# EAGLE design power-new-version (EAGLE 9.5.1)
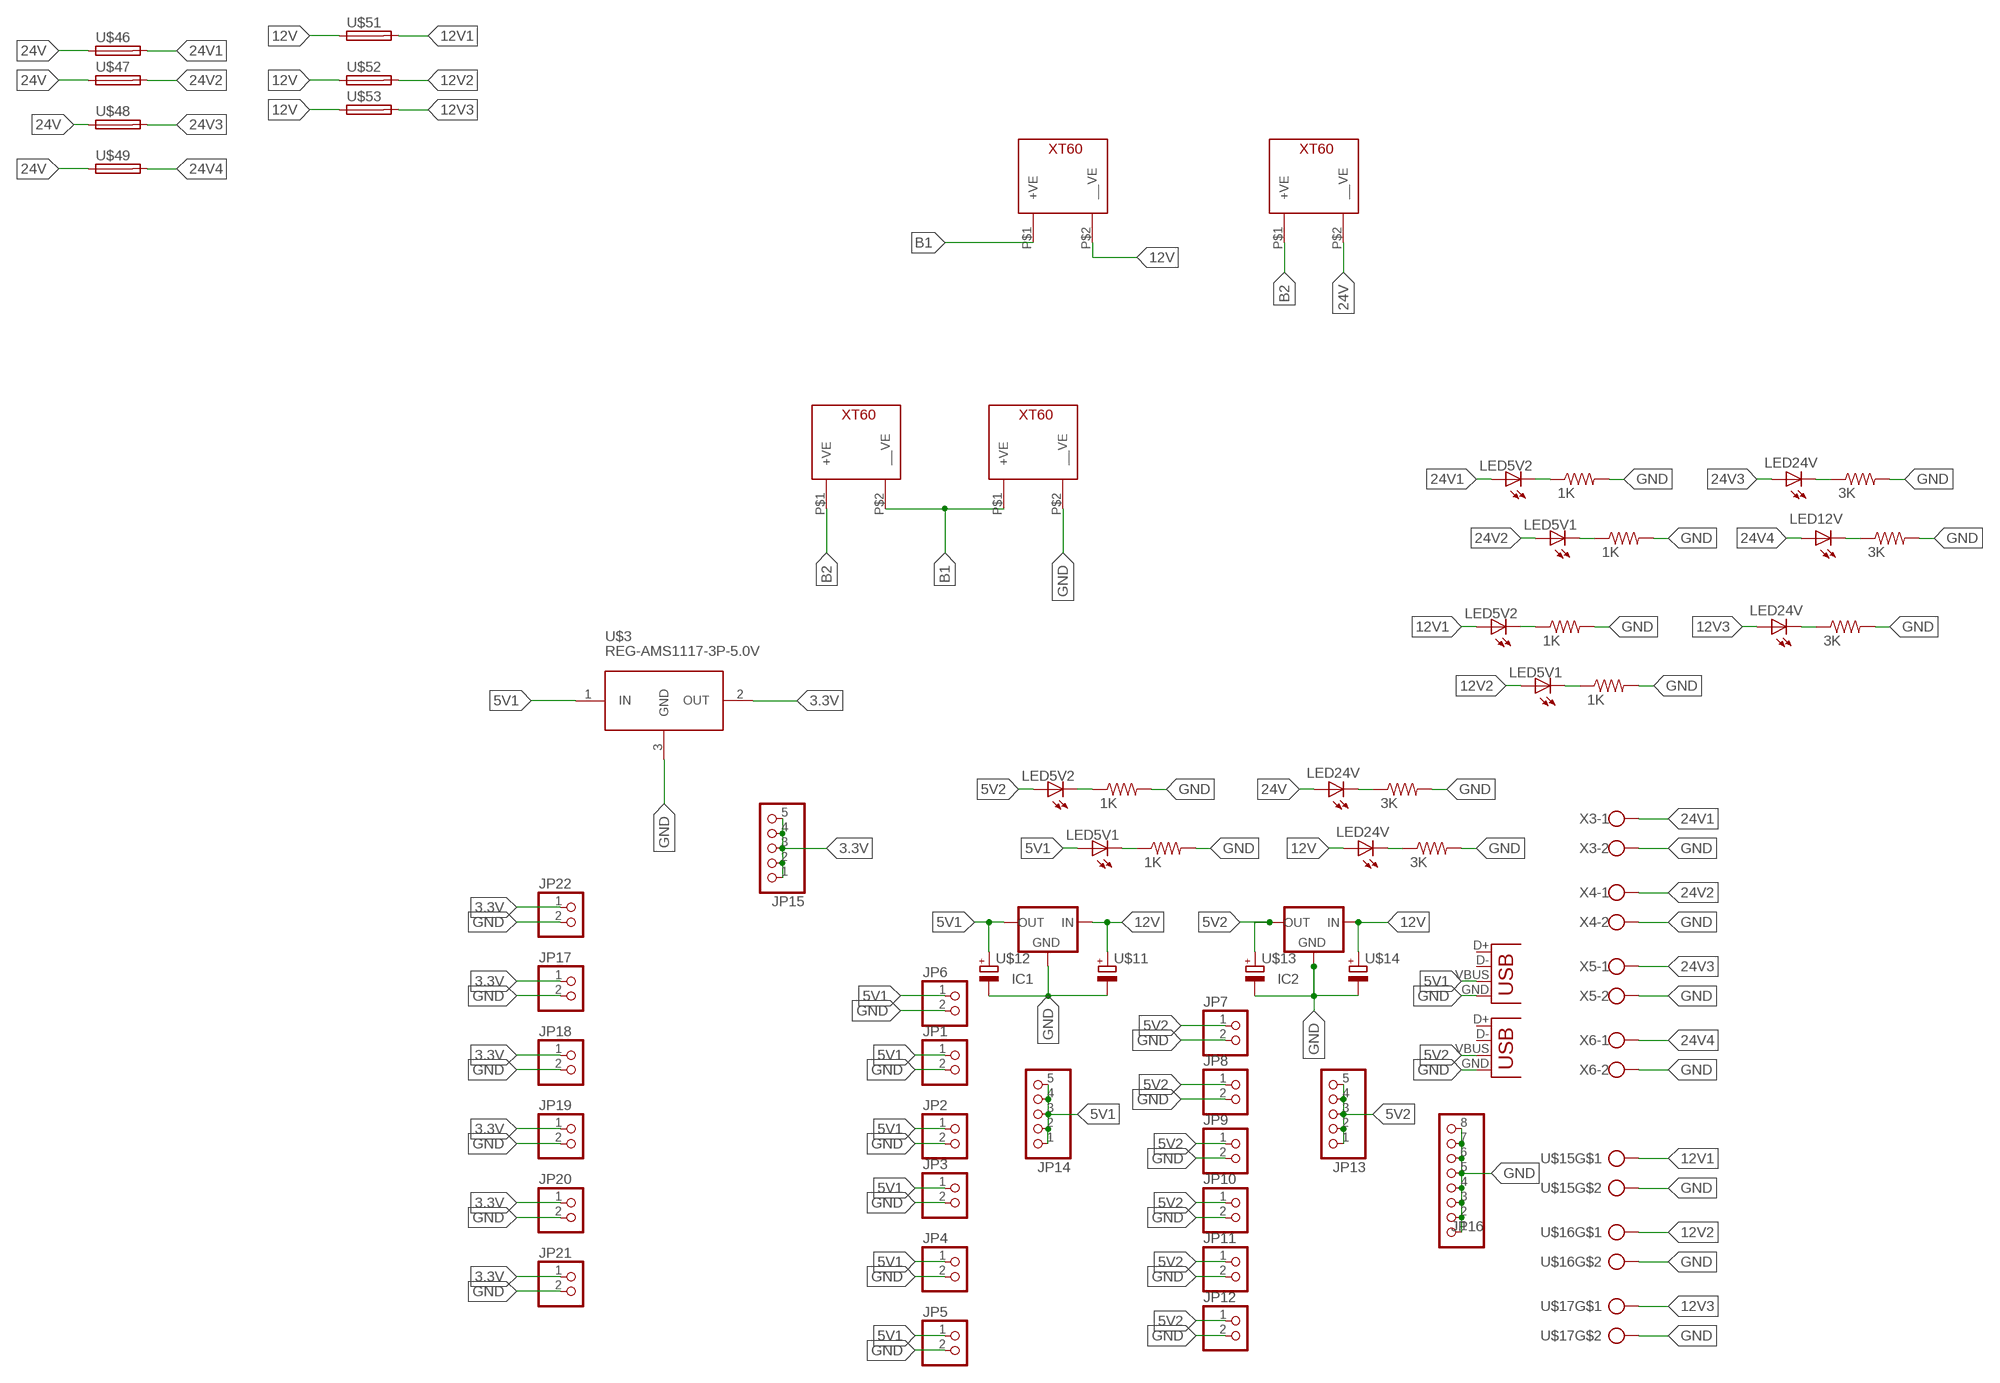
[diagram p0: schematic, sheet 1]

## Parts
1K  1K  RES-7  [0204/7]
1K1  1K  RES-7  [0204/7]
1K2  1K  RES-7  [0204/7]
IC1  78XX-METAL  [TO3-79]
IC2  78XX-METAL  [TO3-79]
JP1  PINHD-2_DATA  [1X02_DATA]
JP2  PINHD-2_DATA  [1X02_DATA]
JP3  PINHD-2_DATA  [1X02_DATA]
JP4  PINHD-2_DATA  [1X02_DATA]
JP5  PINHD-2_DATA  [1X02_DATA]
JP6  PINHD-2_DATA  [1X02_DATA]
JP7  PINHD-2_DATA  [1X02_DATA]
JP8  PINHD-2_DATA  [1X02_DATA]
JP9  PINHD-2_DATA  [1X02_DATA]
JP10  PINHD-2_DATA  [1X02_DATA]
JP11  PINHD-2_DATA  [1X02_DATA]
JP12  PINHD-2_DATA  [1X02_DATA]
JP13  PINHD-1X5  [1X05]
JP14  PINHD-1X5  [1X05]
JP15  PINHD-1X5  [1X05]
JP16  PINHD-1X8  [1X08]
JP17  PINHD-2_DATA  [1X02_DATA]
JP18  PINHD-2_DATA  [1X02_DATA]
JP19  PINHD-2_DATA  [1X02_DATA]
JP20  PINHD-2_DATA  [1X02_DATA]
JP21  PINHD-2_DATA  [1X02_DATA]
JP22  PINHD-2_DATA  [1X02_DATA]
U$1  LED5V2  LED3MM  [LED3MM]
U$2  LED5V1  LED3MM  [LED3MM]
U$3  REG-AMS1117-3P-5.0V  [REG-AMS1117-3P]
U$4  LED24V  LED3MM  [LED3MM]
U$6  XT60_CONNECTOR  [XT60]
U$7  1K  RES-7  [0204/7]
U$8  3K  RES-7  [0204/7]
U$9  3K  RES-7  [0204/7]
U$10  XT60_CONNECTOR  [XT60]
U$11  CAP_POL  [E3,5-8]
U$12  CAP_POL  [E3,5-8]
U$13  CAP_POL  [E3,5-8]
U$14  CAP_POL  [E3,5-8]
U$15  CON_PTR_2  [AK300/2]
U$16  CON_PTR_2  [AK300/2]
U$17  CON_PTR_2  [AK300/2]
U$18  LED5V2  LED3MM  [LED3MM]
U$19  LED5V1  LED3MM  [LED3MM]
U$20  LED24V  LED3MM  [LED3MM]
U$21  LED12V  LED3MM  [LED3MM]
U$22  1K  RES-7  [0204/7]
U$23  3K  RES-7  [0204/7]
U$24  3K  RES-7  [0204/7]
U$25  LED5V2  LED3MM  [LED3MM]
U$26  LED5V1  LED3MM  [LED3MM]
U$27  LED24V  LED3MM  [LED3MM]
U$28  LED24V  LED3MM  [LED3MM]
U$29  1K  RES-7  [0204/7]
U$31  3K  RES-7  [0204/7]
U$44  XT60_CONNECTOR  [XT60]
U$45  XT60_CONNECTOR  [XT60]
U$46  FUSE_PANNEL_MOUNTPANEL_MOUNT  [PANEL_MOUNT]
U$47  FUSE_PANNEL_MOUNTPANEL_MOUNT  [PANEL_MOUNT]
U$48  FUSE_PANNEL_MOUNTPANEL_MOUNT  [PANEL_MOUNT]
U$49  FUSE_PANNEL_MOUNTPANEL_MOUNT  [PANEL_MOUNT]
U$51  FUSE_PANNEL_MOUNTPANEL_MOUNT  [PANEL_MOUNT]
U$52  FUSE_PANNEL_MOUNTPANEL_MOUNT  [PANEL_MOUNT]
U$53  FUSE_PANNEL_MOUNTPANEL_MOUNT  [PANEL_MOUNT]
X1  USB-A-H  [USB-A-H]
X2  USB-A-H  [USB-A-H]
X3  ROSTA.POWER  [W239-302]
X4  ROSTA.POWER  [W239-302]
X5  ROSTA.POWER  [W239-302]
X6  ROSTA.POWER  [W239-302]

## Nets
3.3V: JP15.1 JP15.2 JP15.3 JP15.4 JP15.5 JP17.1 JP18.1 JP19.1 JP20.1 JP21.1 JP22.1 U$3.2(OUT)
5V1: IC1.1(OUT) JP1.1 JP2.1 JP3.1 JP4.1 JP5.1 JP6.1 JP14.1 JP14.2 JP14.3 JP14.4 JP14.5 U$2.A U$3.1(IN) U$12.+ X1.VBUS
5V2: IC2.1(OUT) JP7.1 JP8.1 JP9.1 JP10.1 JP11.1 JP12.1 JP13.1 JP13.2 JP13.3 JP13.4 JP13.5 U$1.A U$13.+ X2.VBUS
12V: IC1.3(IN) IC2.3(IN) U$11.+ U$14.+ U$28.A U$45.P$2(__VE) U$51.P$1 U$52.P$1 U$53.P$1
12V1: U$15.1 U$25.A U$51.P$2
12V2: U$16.1 U$26.A U$52.P$2
12V3: U$17.1 U$27.A U$53.P$2
24V: U$4.A U$44.P$2(__VE) U$46.P$1 U$47.P$1 U$48.P$1 U$49.P$1
24V1: U$18.A U$46.P$2 X3.1
24V2: U$19.A U$47.P$2 X4.1
24V3: U$20.A U$48.P$2 X5.1
24V4: U$21.A U$49.P$2 X6.1
B1: U$6.P$2(__VE) U$10.P$1(+VE) U$45.P$1(+VE)
B2: U$6.P$1(+VE) U$44.P$1(+VE)
GND: 1K1.2 1K2.2 1K.2 IC1.2(GND) IC2.2(GND) JP1.2 JP2.2 JP3.2 JP4.2 JP5.2 JP6.2 JP7.2 JP8.2 JP9.2 JP10.2 JP11.2 JP12.2 JP16.1 JP16.2 JP16.3 JP16.4 JP16.5 JP16.6 JP16.7 JP16.8 JP17.2 JP18.2 JP19.2 JP20.2 JP21.2 JP22.2 U$3.3(GND) U$7.2 U$8.2 U$9.2 U$10.P$2(__VE) U$11.- U$12.- U$13.- U$14.- U$15.2 U$16.2 U$17.2 U$22.2 U$23.2 U$24.2 U$29.2 U$31.2 X1.GND X2.GND X3.2 X4.2 X5.2 X6.2
N$1: 1K1.1 U$18.K(C)
N$2: U$19.K(C) U$22.1
N$3: U$21.K(C) U$23.1
N$4: U$20.K(C) U$24.1
N$5: 1K2.1 U$25.K(C)
N$6: U$26.K(C) U$29.1
N$7: 1K.1 U$1.K(C)
N$8: U$2.K(C) U$7.1
N$9: U$8.1 U$28.K(C)
N$10: U$4.K(C) U$9.1
N$12: U$27.K(C) U$31.1
Unconnected: X1.D+ X1.D- X2.D+ X2.D-

## Library data of the parts
1K 1K1 1K2 U$7-U$9 U$22-U$24 U$29 U$31 = MIA_LIBRARY-2-2-2:RES-7
IC1 IC2 = MIA_LIBRARY-2-2-2:78XX-METAL: VOLTAGE REGULATOR
JP1-JP12 JP17-JP22 = MIA_LIBRARY-2-2-2:PINHD-2_DATA: PIN HEADER
JP13-JP15 = MIA_LIBRARY-2-2-2:PINHD-1X5: PIN HEADER
JP16 = MIA_LIBRARY-2-2-2:PINHD-1X8: PIN HEADER
U$1 U$2 U$4 U$18-U$21 U$25-U$28 = MIA_LIBRARY-2-2-2:LED3MM
U$3 = MIA_LIBRARY-2-2-2:REG-AMS1117-3P-*: Linear Regulator based on AMS1117 chip 3-pin version AMS1117 datasheet is available here: http://www.advanced-monolithic.com/pdf/ds1117.pdf Click here to find device on ebay.com <http://www.ebay.com/sch/ams1117+module> Note: There are many variants. Search for the proper version.
U$6 U$10 U$44 U$45 = MIA_LIBRARY-2-2-2:XT60_CONNECTOR
U$11-U$14 = MIA_LIBRARY-2-2-2:CAP_POL
U$15-U$17 = MIA_LIBRARY-2-2-2:CON_PTR_2
U$46-U$49 U$51-U$53 = MIA_LIBRARY-2-2-2:FUSE_PANNEL_MOUNT
X1 X2 = MIA_LIBRARY-2-2-2:USB: USB Connectors
X3-X6 = MIA_LIBRARY-2-2-2:ROSTA.POWER: WAGO SCREW CLAMP; OC_FARNELL: unknown; OC_NEWARK: unknown

## Board
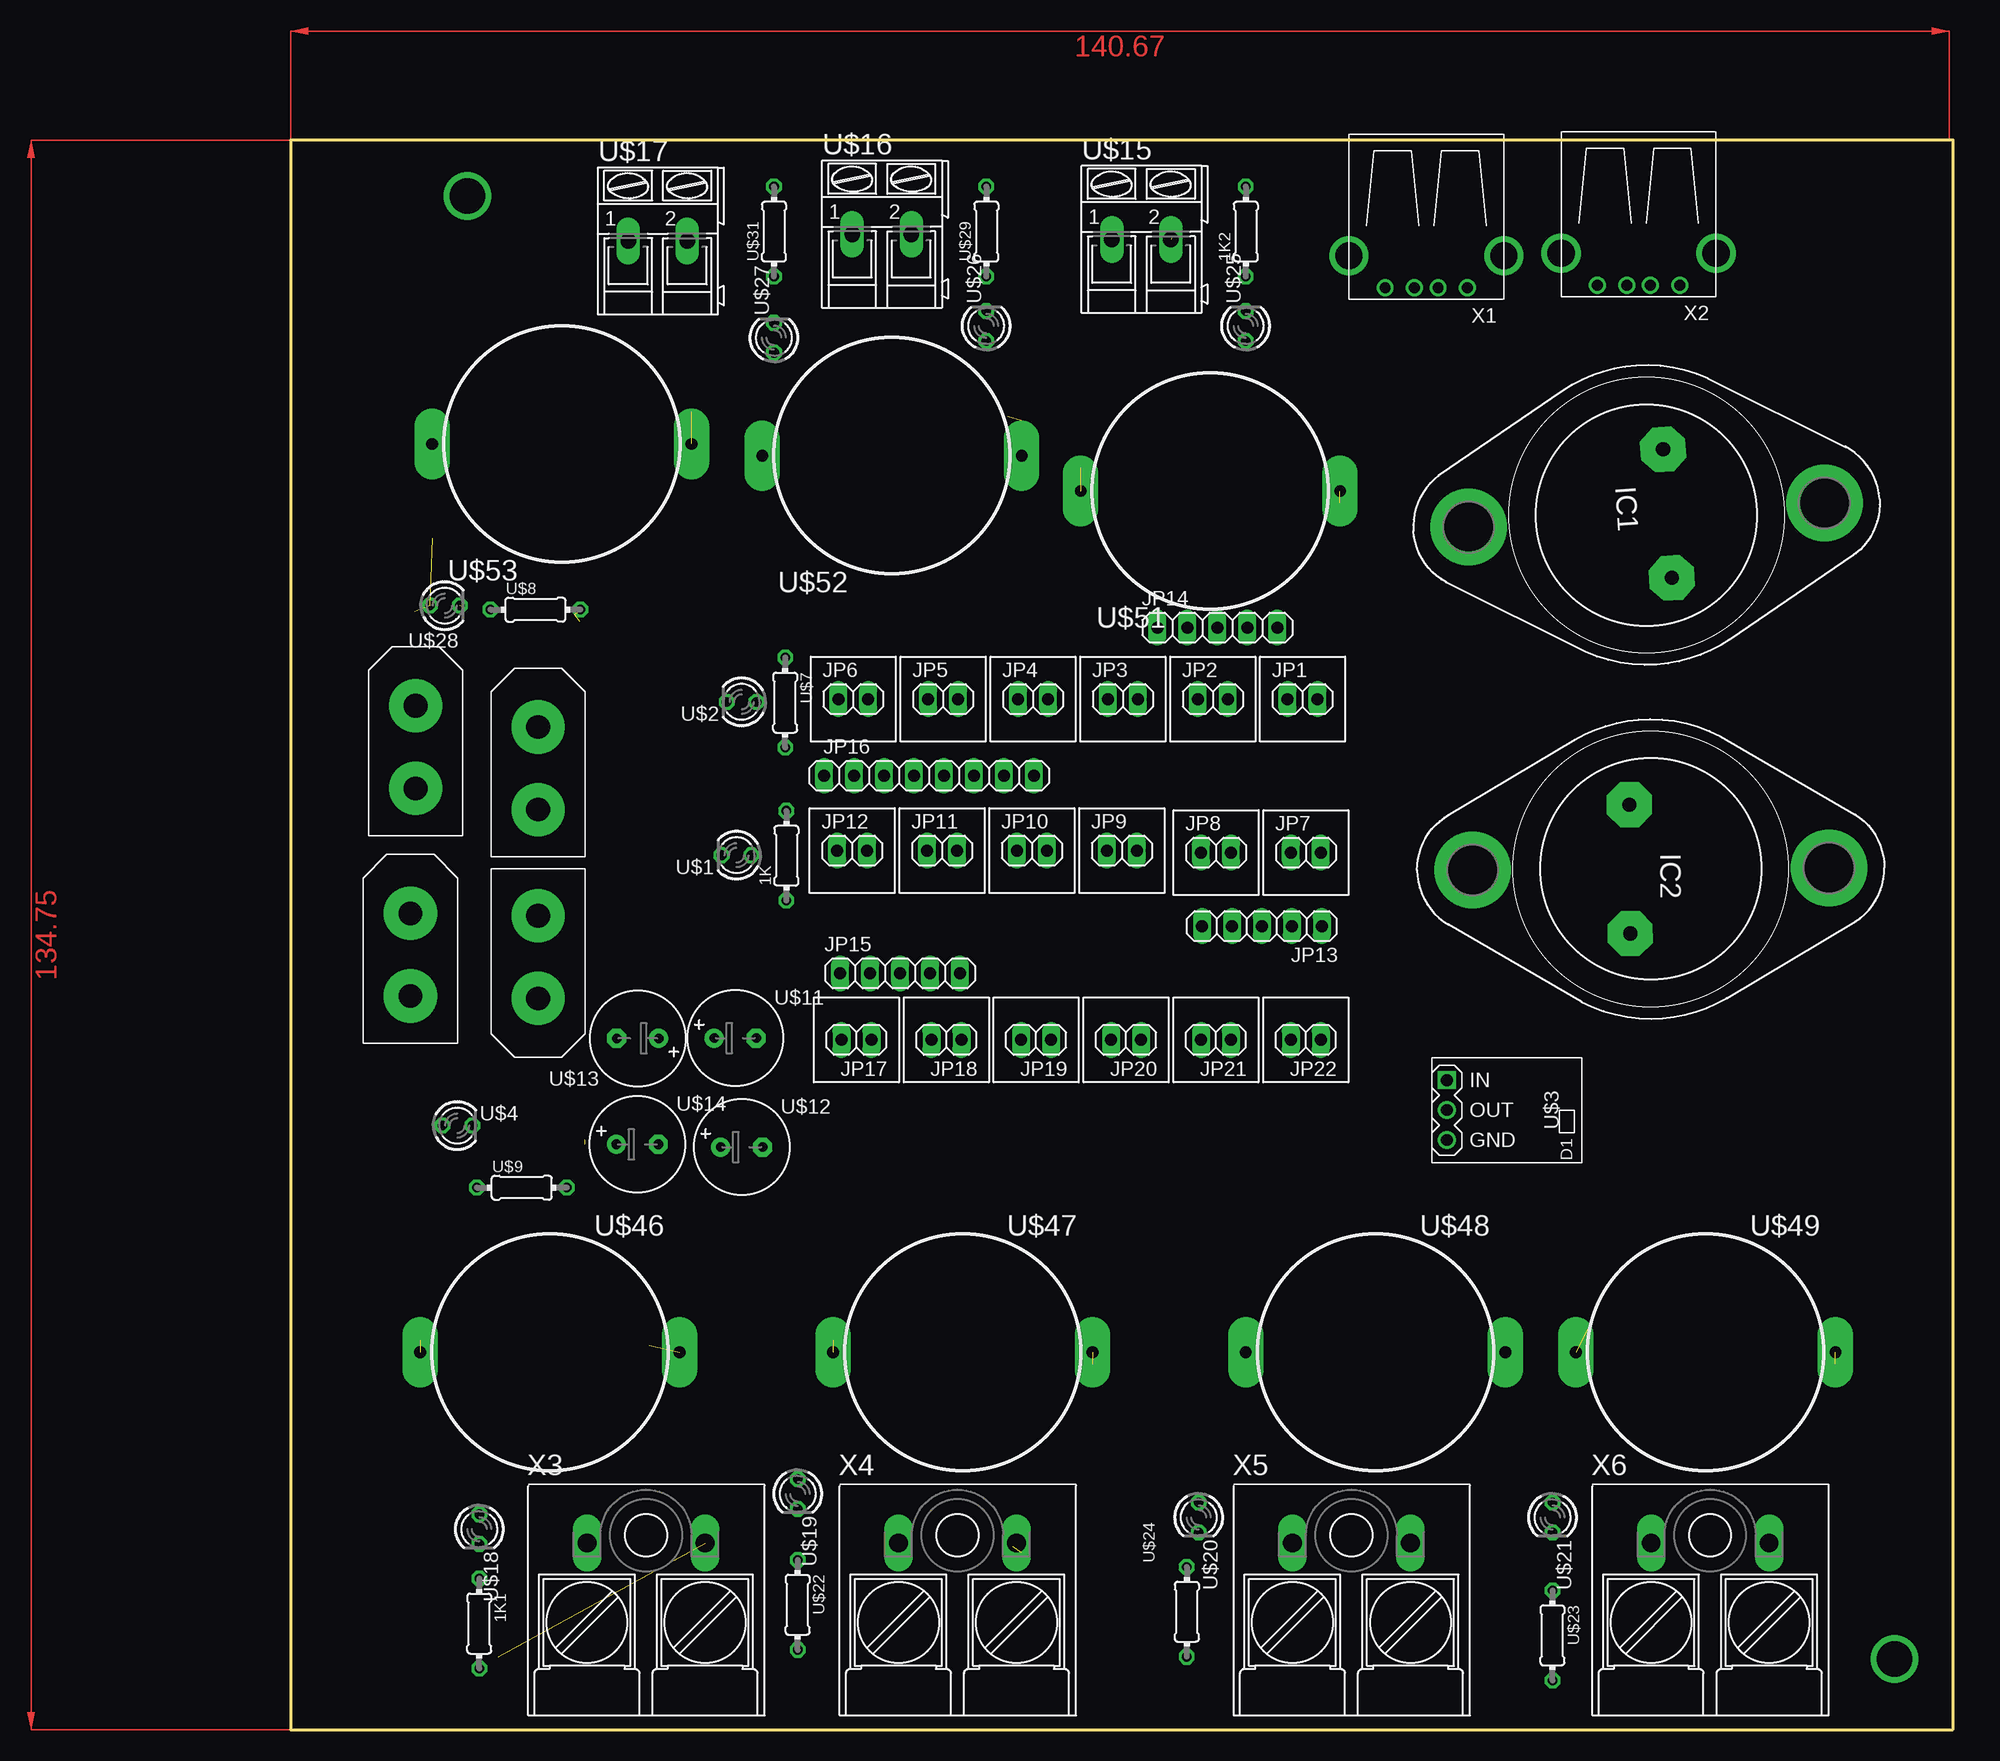
[diagram p1: board, top side]
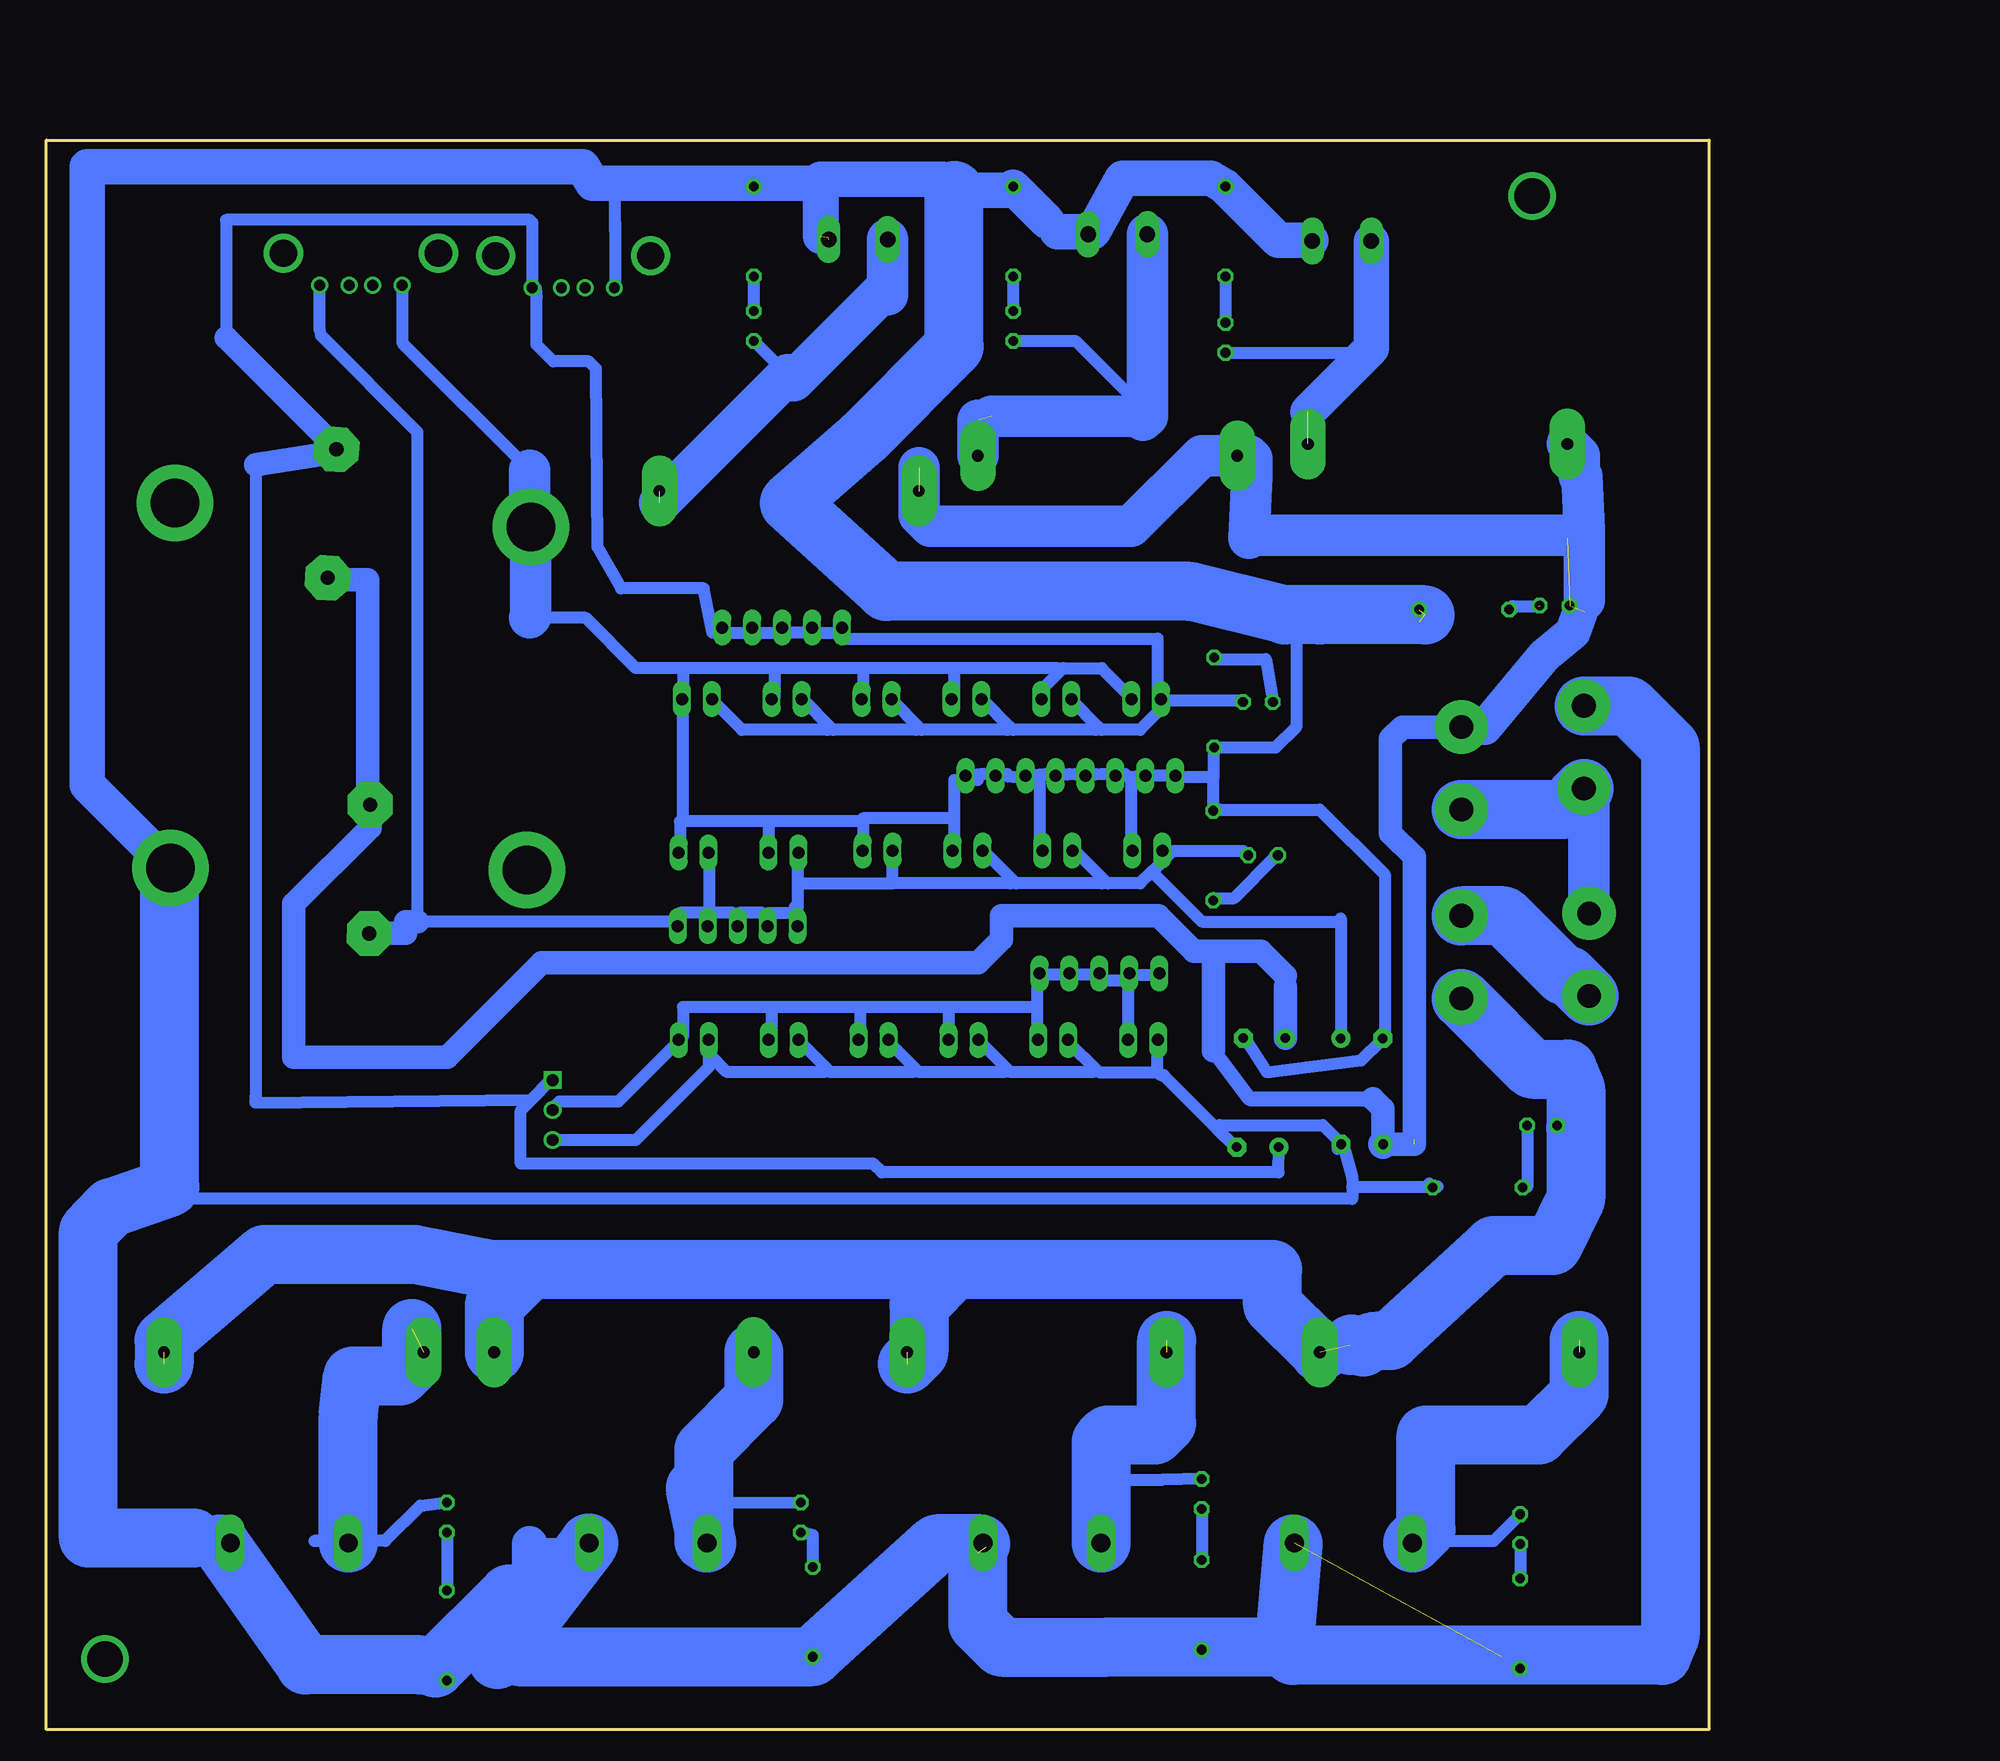
[diagram p2: board, bottom side, seen from below]

Size 140.97 x 134.75 mm. Coordinates in mm from the lower left corner, seen from the top.
Outline: 0,0 140.97,0 140.97,134.75 0,134.75 0,0
Copper layers (1*16): Top 0.035mm / dielectric 1.5mm / Bottom 0.035mm
Design rules "default *": minimum track width 1mm, minimum drill 0.35mm, track to track 0.5mm, track to pad 0.5mm, pad to pad 0.5mm, via to via 0.5mm, smd to smd 6mil, copper to edge 0.8mm, drill to drill 0.8mm, minimum pad ring 10mil, minimum via ring 8mil, stop-mask expansion 4mil, vias tented up to drill 0mil, thermal gap 10mil

### Footprints (pad centres in the part's own frame; a part is rotated, then mirrored left to right if it is on the bottom)
0204/7 = drill 0.813 octagon: 1 -3.81,0; 2 3.81,0
TO3-79 = drill 1.194 pad 3.81 octagon: 1 -1.778,-5.461; 3 -1.778,5.461 | drill 4.115 pad 6.477: 2 15.113,0; 3@ -15.113,0
1X02_DATA = drill 1.016 long: 1 -1.27,0; 2 1.27,0
1X05 = drill 1.016 long: 1 -5.08,0; 2 -2.54,0; 3 0,0; 4 2.54,0; 5 5.08,0
1X08 = drill 1.016 long: 1 -8.89,0; 2 -6.35,0; 3 -3.81,0; 4 -1.27,0; 5 1.27,0; 6 3.81,0; 7 6.35,0; 8 8.89,0
LED3MM = drill 0.813 octagon: A -1.27,0; K 1.27,0
REG-AMS1117-3P = drill 1 square: 1 -2.54,-5.08 | drill 1: 2 0,-5.08; 3 2.54,-5.08
XT60 = drill 2 pad 4.5: P$1 -4,-4; P$2 -11,-4
E3,5-8 = drill 0.813 pad 1.6: + -1.778,0 | drill 0.813 pad 1.6 octagon: - 1.778,0
AK300/2 = drill 1.321 long: 1 -2.515,0; 2 2.489,0
PANEL_MOUNT = drill 1 pad 3 long: P$1 -11,0; P$2 11,0
USB-A-H = drill 0.914: D+ 2.718,-1.003; D- 2.718,1.003; GND 2.718,-3.493; VBUS 2.718,3.493 | drill 2.311: P$5 0,-6.566; P$6 0,6.566
W239-302 = drill 1.6 long: 1 -5,5; 2 5,5

### Placement (x,y rotation side)
1K  42.05,74.09 90 top
1K1  16,9 270 top
1K2  81,127 90 top
IC1  114.98,102.97 183.9 top
IC2  115.34,72.97 0.3 top
JP1  85.82,87.36 0 top
JP2  78.2,87.36 0 top
JP3  70.58,87.36 0 top
JP4  62.96,87.36 0 top
JP5  55.34,87.36 0 top
JP6  47.72,87.36 0 top
JP7  86.1,74.36 0 top
JP8  78.48,74.36 0 top
JP9  70.49,74.52 0 top
JP10  62.87,74.52 0 top
JP11  55.25,74.52 0 top
JP12  47.63,74.52 0 top
JP13  82.37,68.13 180 top
JP14  78.59,93.43 0 top
JP15  51.69,64.11 0 top
JP16  54.14,80.87 0 top
JP17  47.99,58.48 180 top
JP18  55.61,58.48 180 top
JP19  63.23,58.48 180 top
JP20  70.85,58.48 180 top
JP21  78.47,58.48 180 top
JP22  86.09,58.48 180 top
U$1  37.82,74.13 180 top
U$2  38.25,87.13 180 top
U$3  103.13,52.53 270 top
U$4  14.14,51.22 0 top
U$6  14.17,58.2 270 top
U$7  41.95,87.07 270 top
U$8  20.77,94.95 0 top
U$9  19.61,45.95 0 top
U$10  14.61,75.8 270 top
U$11  37.71,58.63 0 top
U$12  38.26,49.39 0 top
U$13  29.44,58.61 180 top
U$14  29.41,49.63 0 top
U$15  72.15,126.34 0 top
U$16  50.15,126.77 0 top
U$17  31.15,126.2 0 top
U$18  16,17 270 top
U$19  43,20 270 top
U$20  77,18 270 top
U$21  107,18 270 top
U$22  43,10.59 270 top
U$23  107,8 270 top
U$24  76,10 270 top
U$25  81,119 90 top
U$26  59,119 90 top
U$27  41,118 90 top
U$28  13.08,95.3 0 top
U$29  59,127 90 top
U$31  41,127 90 top
U$44  17,73 90 top
U$45  25,74 270 top
U$46  22,32 180 top
U$47  57,32 180 top
U$48  92,32 180 top
U$49  120,32 180 top
U$51  78,105 0 top
U$52  51,108 0 top
U$53  23,109 0 top
X1  96.31,124.95 270 top
X2  114.31,125.17 270 top
X3  30.14,10.83 0 top
X4  56.55,10.83 0 top
X5  89.96,10.83 0 top
X6  120.37,10.83 0 top

### Tracks (layer width: path | path; a pad name or v marks a point on that pad's centre or on a via)
3.3V
  Bottom 1: U$3.2 98,52.75 97.5,53.25 92.5,53.25 87.5,58.25 JP22.1 87,58.75 87,61.25 79.5,61.25 | JP15.1 46.75,64 49,64 JP15.2 | JP17.1 49.25,58.5 49.25,63.5 JP15.2 | JP15.2 49.75,63.5 51.25,63.5 51.5,63.75 JP15.3 52,64 54,64 JP15.4 54.5,64 56.75,64 JP15.5 57,63.5 57,61.25 | 57,61.25 57,58.5 JP18.1 | 64.5,61.25 JP19.1 | 57,61.25 64.5,61.25 | 72,61.25 72,58.5 JP20.1 | 64.5,61.25 72,61.25 | 79.5,61.25 79.5,58.5 JP21.1 | 72,61.25 79.5,61.25
5V1
  Bottom 1: 99.83,53.42 100.76,52.49 100.76,48 100.65,48 70.88,48 70.13,47.25 36.5,47.25 U$12.+ | 99.83,53.42 98.25,55 U$3.1 | U$2.A 39.75,87.25 46.25,87.25 JP6.1 | 51.75,85 51.5,84.75 48.25,84.75 46.25,86.75 JP6.1 | 51.75,85 54,87.25 JP5.1 | 59.25,85 59,84.75 52,84.75 51.75,85 | 59.25,85 61.5,87.25 JP4.1 | 67,85 66.75,84.75 59.5,84.75 59.25,85 | 67,85 69.25,87.25 JP3.1 | 74.5,85 74.25,84.75 67.25,84.75 67,85 | 74.5,85 76.75,87.25 JP2.1 | JP1.1 84.5,87.25 82,84.75 74.75,84.75 74.5,85 | 125.75,118 125.75,128 100,128 99.75,127.75 99.75,122.75 X1.VBUS 99.48,122.23 99.41,121.34 99.41,117.41 98,116 95,116 94.38,115.38 94.25,100.25 92.25,96.75 85.25,96.75 84.5,93 83.75,93 JP14.5 83.25,93 81.25,93 JP14.4 80.75,93 79,93 JP14.3 78.5,93 76.5,93 JP14.2 76,93 73.75,93 JP14.1 73.25,92.5 46.75,92.5 46.75,87.75 JP6.1 | 116.5,108.75 IC1.1 116.75,108.25 | 99.83,53.42 123.26,53.17 123.25,53.68 123.25,107.25
  Bottom 2: 125.75,118 116.5,108.75 | 116.75,108.25 123.25,107.25
5V2
  Bottom 1: X2.VBUS 117.8,118.6 117.7,118.2 109.5,110 109.5,68.5 88,68.5 87.75,68.75 JP13.1 87.25,69.25 85.25,69.25 JP13.2 | 113.5,67.5 IC2.1 | 77.25,71.75 77.25,69.75 77.5,69.75 JP13.5 77.5,69.25 79.75,69.25 JP13.4 80.25,69.25 82.25,69.25 JP13.3 82.75,69.25 84.75,69.25 JP13.2 | 77.25,71.75 77.25,74.25 JP8.1 | 69.25,71.75 69.25,74.5 JP9.1 | 77.25,71.75 69.25,71.75 | JP7.1 84.75,74.25 84.75,69.75 JP13.2 | U$1.A 39.25,74.25 39.5,74.5 46.25,74.5 JP12.1 45.75,74.25 47.25,72.75 | 51.25,72 51,71.75 48.25,71.75 47.25,72.75 | 51.25,72 53.75,74.5 JP11.1 | 59,72 58.75,71.75 51.5,71.75 51.25,72 | 59,72 61.5,74.5 JP10.1 | 47.25,72.75 43,68.5 31.5,68.5 31.22,68.78 U$13.+ | 69.25,71.75 59.25,71.75 59,72
  Bottom 2: 113.5,67.5 110.5,67.5 110.5,68.5 109.5,68.5
12V  (4 unrouted)
  Bottom 1: 11,106.25 10.5,106.25 10.5,101.25 11,101.25 12,101.25 12.75,102 20,102 19.67,101.67 10.55,101.67 | 113.75,78.5 IC2.3 | 117,97.5 IC1.3 | 12,101 10,101
  Bottom 1.016: 10.53,94.78 10.55,95.76
  Bottom 1.27: 28.5,53.5 38.96,53.5 42.04,57.57 | 35.93,63 35.93,63.93
  Bottom 2: 113.75,78.5 113.75,97.5 117,97.5 | 25,49.63 U$14.+ | IC2.3 113.53,76.47 120,70 120,57 107,57 99,65 62,65 60,67 60,69 46.68,69 43.68,66 42,66 | U$14.+ 27.64,52.64 28.5,53.5 | 42,66 38,66 35.93,63.93 | U$11.+ 35.93,63 | 42.04,57.57 42.04,64.96 42,65 42,66 | U$45.P$2 26,85 27,84 27,76 25,74 25,50
  Bottom 2.5: U$14.+
  Bottom 3: U$45.P$2 19,85 13.95,91.05 11.55,93.05 10.55,95.76
  Bottom 3.5: 11,101.25 38.75,101.25 39,101 38.75,106.25 38.75,107.75 39,108 U$52.P$1 43,108 49,102 66,102 67,103 67,107 | 10.55,95.76 10.55,101.67 10.8,106.25 11,106.25 11,108 U$53.P$1
12V1  (1 unrouted)
  Bottom 1: 69.75,126.25 U$15.1 | U$25.A 78.14,114.87 77.64,114.37
  Bottom 3.5: U$15.1 69.63,121.63 70,122 77.64,114.37 | 78.14,114.87 89,104
12V2  (1 unrouted)
  Bottom 1: U$26.A 53.73,117.73 47.63,111.63 47.63,111.37
  Bottom 3.5: U$16.1 47.63,111.37 | 47.63,111.37 48,111 | 47.63,111.37 60.83,111.37 | U$52.P$2 62,111
12V3  (1 unrouted)
  Bottom 1: U$27.A 29,116.73 28.27,116.73 28,117
  Bottom 3: U$17.1 28.64,117.09 29,116.73 34,111.73
24V  (3 unrouted)
  Bottom 1: U$4.A 12.65,51 11.3,51
  Bottom 5: 30.4,32.58 30.29,32.69 29.32,32.45 28.61,32.88 27,33 18.32,41 18.28,41.04 13.26,41.04 11.3,45 11.3,51 11.3,54.3 12,56 15,56 U$44.P$2 | U$46.P$1 37,36 37,39 64,39 | 64,39 67,36 67,32 68,31 | 64,39 100,39 | U$48.P$1 103,36 100,39 | 100,39 103.22,39 109.71,40.28 122.51,40.28 131,33 131,31
24V1  (1 unrouted)
  Bottom 1: U$18.A 16,18.25 18.25,16 25,16 X3.1
  Bottom 5: X3.1 24,16.97 24,25 14.46,25 11,28.46 11,33
24V2  (1 unrouted)
  Bottom 1: U$19.A 46.3,21.21 51.91,21.21 X4.1 52,16
  Bottom 5: X4.1 51.55,24.45 51,25 47,25 46,26 46,33
24V3
  Bottom 1: X5.1 85.75,16 85.25,16 85,19.25 U$20.A 77.11,19.29
  Bottom 5: X5.1 85.96,20.5 | U$48.P$2 81,28 85.25,23.75 85.25,16
24V4  (1 unrouted)
  Bottom 1: X6.1 118.25,16 112.25,16 109.25,19 U$21.A
  Bottom 5: X6.1 115.37,26.63 115,30 111,30 110,31 110,34
B1
  Bottom 3.5: U$6.P$2 10.17,79.36 U$10.P$1
  Bottom 5: U$10.P$1 12.41,78 U$45.P$1
B2
  Bottom 5: U$6.P$1 11.92,63.95 12.35,63.95 17.39,69 U$44.P$1
GND  (6 unrouted)
  Bottom 1: 55.25,127 56.12,127.88 | 59,130.75 U$29.2 59.25,130.5 | 52.75,127 U$16.2 52.25,127 | 41,130.75 U$31.2 | 33.75,126.25 U$17.2 | 74.75,126.5 75.3,127.05 | 1K2.2 80.73,131.07 75.3,131.07 | 92.75,127.75 92.75,127 92.75,122.25 X1.GND | 74.25,126.5 U$15.2 | U$11.- 39.25,58.5 37.5,55.75 29.5,56.75 27.75,58.5 U$13.- 27.5,59 | 34,95 U$8.2 | 100,106.75 110.75,117.5 110.75,122.25 X2.GND | 100,102 IC1.2 | 55,89.75 56.5,88.25 56.5,87.5 JP5.2 | 55,89.75 54.75,90 51.5,90 49,87.5 JP6.2 | 64,90 64,87.5 JP4.2 | 64,90 55.25,90 55,89.75 | 71.75,90 71.75,87.5 JP3.2 | 64,90 71.75,90 | 79.25,90 79.25,87.5 JP2.2 | 71.75,90 79.25,90 | 87,90 87,87.5 JP1.2 87,87 87,77.25 87.25,77 | 79.25,90 87,90 | 87,90 91,90 95.25,94.25 100,94.25 | U$7.2 42,83.25 42,80.75 42,78 1K.2 41.5,78 | JP12.2 49,74.75 49,80.75 JP16.3 | 48.5,80.75 JP16.3 | JP16.3 49.5,81 51.5,81 JP16.4 52,81 53.75,81 JP16.5 54.25,81 56.25,81 JP16.6 | JP11.2 56.75,74.75 56.75,80.75 JP16.6 | JP16.6 57.25,80.75 59,80.75 JP16.7 59.5,81 61.75,81 JP16.8 62,80.5 64,80.5 64,77.25 | 64,77.25 64,74.75 JP10.2 | 71.75,77 71.75,77.25 64,77.25 | 71.75,77 71.75,74.75 JP9.2 | 79.75,77 JP8.2 | 71.75,77 79.75,77 | 87.25,77 87.25,74.5 JP7.2 | 79.75,77 87.25,77 | 85,57.5 85,58.25 JP22.2 84.75,57.25 83.25,55.75 75,55.75 74.75,56 | 22.99,46.06 23.49,46.06 23.74,46.31 23.49,46.02 U$9.2 | 30.25,46.75 31,49.5 U$14.- | 46.75,55.75 46.75,58.25 JP17.2 | 46.75,55.75 51.75,55.75 52,56 | 52,56 54.25,58.25 JP18.2 | 59.5,56 59.25,55.75 52.25,55.75 52,56 | 59.5,56 61.75,58.25 JP19.2 | 67.25,56 67,55.75 59.75,55.75 59.5,56 | 67.25,56 69.5,58.25 JP20.2 | 74.75,56 74.5,55.75 67.5,55.75 67.25,56 | 74.75,56 77,58.25 JP21.2 | 41.75,51 46.25,55.5 46.5,55.5 46.75,55.75
  Bottom 1: 41.75,51 40.25,49.5 U$12.- | U$14.- 31.5,50 32.75,51.25 41.5,51.25 41.75,51 | 76,6.25 U$24.2 | 61.75,15.75 X4.2 61.25,15.5 | 17.62,6.19 17,6.25 16.06,6.25 1K1.2 | 50.75,5.5 43.25,5.5 U$22.2 | 35.25,15.75 X3.2 | 100,13.25 100.75,12.5 | 108,5.25 U$23.2 109.25,5.5 | 100,15.75 X5.2 | 126.25,15.75 X6.2 128.5,16.25 | 130.5,73 IC2.2 | 31.5,49.25 U$14.-
  Bottom 1.016: 51,7 50.75,6.75 50.75,5.5 | 92.75,127 92.75,130.82 93,131.07 | 30.25,46.75 30.25,46 | 30.25,46 30.25,45 129.5,45 130.5,46 | JP22.2 84.82,56.18 91.01,49.99 U$3.3 | 22.99,46.06 23.05,46 30.25,46 | 24.57,93.92 24.81,93.92 | 33,94.5 35,92.5 35,85 36.75,83.25 42,83.25 | 41.5,78 33,78 27.5,72.5 27.5,59 | 42,80.75 45.13,80.75 JP16.1 JP16.2 48.38,80.87 48.5,80.75
  Bottom 2.54: 64,130.45 65,131.45 | 99.96,9.29 101.02,8.23
  Bottom 3: 56.12,127.88 59,130.75 | 52.75,127 55.25,127 | 41,130.75 36.5,126.25 33.75,126.25 | 52.25,127 49.75,131.5 42.25,131.5 U$31.2 | 75.3,127.05 75.3,131.07 93,131.07 94.67,131.07 95.5,132.5 137.5,132.5 137.5,80.1 IC2.2 | 64,130.5 59.25,130.5 | 102.75,5.97 101.02,8.23 | 100,15.75 100,13.25 | 65,131.45 75.35,131.45 75.35,126.6
  Bottom 3.5: 100,102 100,106.75 | 100,94.25 99.9,94.35 IC1.2
  Bottom 5: 76,6.25 65.5,15.75 61.75,15.75 | 36,7 35.25,15.75 | 102.75,5.97 101.75,11.5 108,5.25 | 126.25,15.75 119,5.5 109.25,5.5 | 130.5,73 130.5,46 135.5,44.25 137.41,42.25 137.41,16.25 128.5,16.25 | 101.02,8.23 100.92,6.19 U$24.2 | 64,130.5 64,130.45 64,117.25 71.75,109.5 78,104 69.75,96.5 44,96.5 36,94.5 33,94.5 24.07,94.5 | X5.2 99.96,9.29 | 36,7 51,7 60,7 62,9 62,15 | U$10.P$2 6.8,86.8 3.3,83.3 3.3,8 4,6.3 35.3,6.3 36,7
N$1
  Bottom 1: U$18.K 1K1.1
N$2
  Bottom 1.016: U$19.K U$22.1
N$3
  Bottom 1: U$21.K U$23.1
N$4
  Bottom 1: U$24.1 76,16.5 U$20.K
N$5
  Bottom 1: 1K2.1 U$25.K
N$6
  Bottom 1: U$29.1 U$26.K
N$7
  Bottom 1: U$1.K 36.75,74 40.25,70.5 42,70.5 1K.1
N$8
  Bottom 1: U$2.K 37.58,90.75 41.75,90.75 U$7.1
N$9  (1 unrouted)
  Bottom 1: U$8.1 16.66,95.25 14.45,95.25
N$10
  Bottom 1: U$4.K 15.41,46 15.82,46 U$9.1
N$11  (via drill 3)
  other vias: 136,6
N$12
  Bottom 1: U$31.1 U$27.K
N$13  (via drill 3)
  other vias: 15,130
(copper drawn outside any net)
  shapes: Top area x2